# EAGLE schematic Lämpötila Näytöllä (EAGLE 9.5.2)
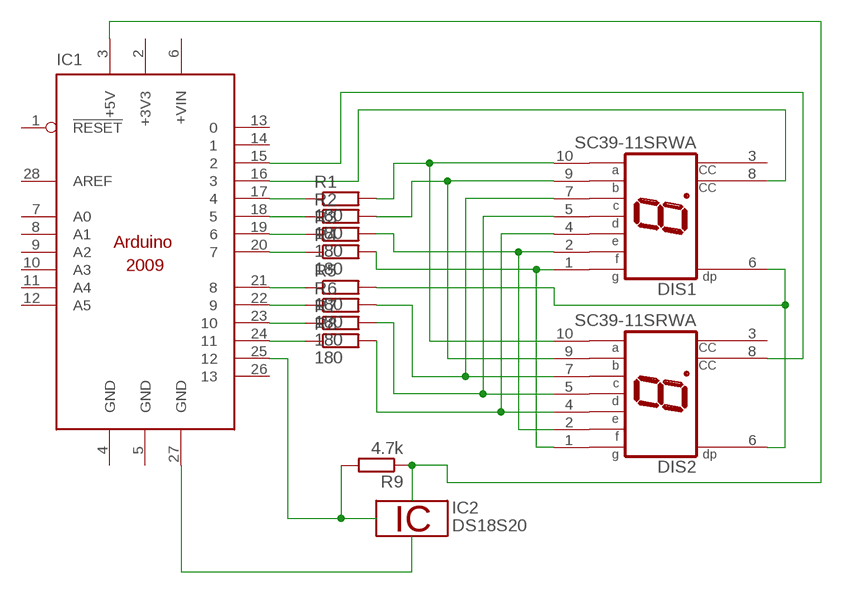
[diagram p0: schematic, sheet 1]

## Parts
DIS1  SC39-11SRWA  [HDSP-E]
DIS2  SC39-11SRWA  [HDSP-E]
IC1  ARDUINO2009_10  [ARDUINO2009]
IC2  DS18S20  [TO92-]
R1  180  R-EU_0207/10  [0207/10]
R2  180  R-EU_0207/10  [0207/10]
R3  180  R-EU_0207/10  [0207/10]
R4  180  R-EU_0207/10  [0207/10]
R5  180  R-EU_0207/10  [0207/10]
R6  180  R-EU_0207/10  [0207/10]
R7  180  R-EU_0207/10  [0207/10]
R8  180  R-EU_0207/10  [0207/10]
R9  4.7k  R-EU_0207/10  [0207/10]

## Nets
GND: IC1.27(GND)
N$1: DIS1.8(CC) IC1.16
N$2: DIS2.8(CC) IC1.15
N$3: DIS1.1(G) DIS2.1(G) R4.2
N$4: DIS1.2(F) DIS2.2(F) R3.2
N$5: DIS1.4(E) DIS2.4(E) R8.2
N$6: DIS1.5(D) DIS2.5(D) R7.2
N$7: DIS1.7(C) DIS2.7(C) R6.2
N$8: DIS1.9(B) DIS2.9(B) R2.2
N$9: DIS1.10(A) DIS2.10(A) R1.2
N$10: IC1.17 R1.1
N$11: IC1.18 R2.1
N$12: IC1.19 R3.1
N$13: IC1.20 R4.1
N$14: IC1.21 R5.1
N$15: IC1.22 R6.1
N$16: IC1.23 R7.1
N$17: IC1.24 R8.1
N$18: IC1.25 R9.2
N$21: DIS1.6(DP) DIS2.6(DP) R5.2
VDD: IC1.3(+5V) R9.1
Unconnected: DIS1.3(CC) DIS2.3(CC) IC1.1(!RESET) IC1.6(+VIN) IC1.7(A0) IC1.8(A1) IC1.9(A2) IC1.10(A3) IC1.11(A4) IC1.12(A5) IC1.13 IC1.14 IC1.26 IC1.28(AREF)

## Power pins joined to a net without a drawn wire
1W: IC2.2
+3V3: IC1.2(+3V3)
GND: IC1.4(GND) IC1.5(GND) IC2.1
VDD: IC2.3

## Library data of the parts
DIS1 DIS2 = display-hp:SC39-11SRWA: SINGLE DIGIT NUMERIC DISPLAY 9.9mm (0.39INCH) Source: SC39-11SRWA.pdf; OC_FARNELL: unknown; OC_NEWARK: unknown
IC1 = arduino:ARDUINO2009_1: The Arduino Duemilanove ("2009") is a microcontroller board based on the ATmega168 or ATmega328. - 14 digital input/output pins (of which 6 can be used as PWM outputs) - 6 analog inputs, a 16 MHz crystal oscillator - USB connection - power jack - ISP header - reset button It contains everything needed to support the microcontroller; simply connect it to a computer with a USB cable or power it with a AC-to-DC adapter or battery to get started http://arduino.cc/en/Main/ArduinoBoardDuemilanove
IC2 = 1wire:DS18S20: High Precision Digital Thermometer This chip provides a onewire thermosensor with approx. 0.5°C accuracy.A programmable over/undertemperure alarm is available. Notes: Vdd must be applied for accurate measurements at low temperatures, as the parasite power circuit otherwise heats the sensor. If parasite power is used, Vdd has to be connected to GND. The DS1822 is a low-cost thermometer chip, the DS18B20 is similar to the DS18S20, but with 9..12 Bit programmable precision. Author: Jan Kandziora <jjj@gmx.de>
R1-R9 = rcl:R-EU_: RESISTOR, European symbol; SPICEPREFIX: R